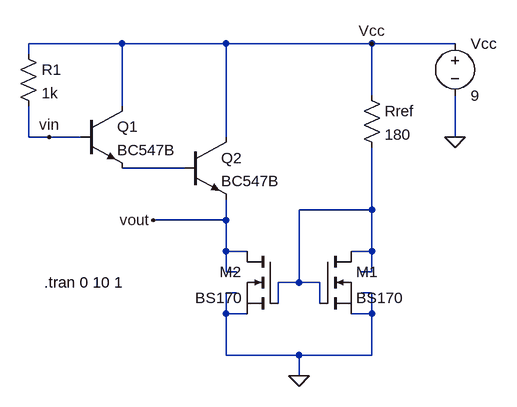
[diagram p0: schematic polasc.asc]
polasc.asc, the LTspice schematic file:
Version 4
SHEET 1 880 680
WIRE 176 16 32 16
WIRE 336 16 176 16
WIRE 560 16 336 16
WIRE 688 16 560 16
WIRE 32 32 32 16
WIRE 560 96 560 16
WIRE 176 112 176 16
WIRE 32 160 32 112
WIRE 64 160 32 160
WIRE 112 160 64 160
WIRE 336 160 336 16
WIRE 688 160 688 96
WIRE 272 208 176 208
WIRE 560 272 560 176
WIRE 560 272 448 272
WIRE 336 288 336 256
WIRE 336 288 224 288
WIRE 336 336 336 288
WIRE 368 336 336 336
WIRE 560 336 560 272
WIRE 560 336 528 336
WIRE 336 368 336 336
WIRE 352 368 336 368
WIRE 560 368 560 336
WIRE 560 368 544 368
WIRE 448 384 448 272
WIRE 448 384 416 384
WIRE 480 384 448 384
WIRE 352 400 336 400
WIRE 560 400 544 400
WIRE 416 416 416 384
WIRE 480 416 480 384
WIRE 336 432 336 400
WIRE 368 432 336 432
WIRE 560 432 560 400
WIRE 560 432 528 432
WIRE 336 496 336 432
WIRE 448 496 336 496
WIRE 560 496 560 432
WIRE 560 496 448 496
WIRE 448 528 448 496
FLAG 688 160 0
FLAG 64 160 vin
FLAG 448 528 0
FLAG 224 288 vout
FLAG 560 16 Vcc
SYMBOL npn 112 112 R0
SYMATTR InstName Q1
SYMATTR Value BC547B
SYMBOL npn 272 160 R0
SYMATTR InstName Q2
SYMATTR Value BC547B
SYMBOL res 16 16 R0
SYMATTR InstName R1
SYMATTR Value 1k
SYMBOL voltage 688 0 R0
WINDOW 123 0 0 Left 0
WINDOW 39 0 0 Left 0
SYMATTR InstName Vcc
SYMATTR Value 9
SYMBOL res 544 80 R0
SYMATTR InstName Rref
SYMATTR Value 180
SYMBOL nmos 480 336 R0
SYMATTR InstName M1
SYMATTR Value BS170
SYMBOL nmos 416 336 M0
SYMATTR InstName M2
SYMATTR Value BS170
TEXT 56 384 Left 2 !.tran 0 10 1

The netlist it stands for:
* polasc.asc
Q1 Vcc vin N001 0 BC547B
Q2 Vcc N001 vout 0 BC547B
R1 Vcc vin 1k
Vcc Vcc 0 9
Rref Vcc N002 180
M1 N002 N002 0 0 BS170
M2 vout N002 0 0 BS170
.model NPN NPN
.model PNP PNP
.lib standard.bjt
.model NMOS NMOS
.model PMOS PMOS
.lib standard.mos
.tran 0 10 1
.backanno
.end

* Results of the author's LTspice run, read from the files saved beside the schematic
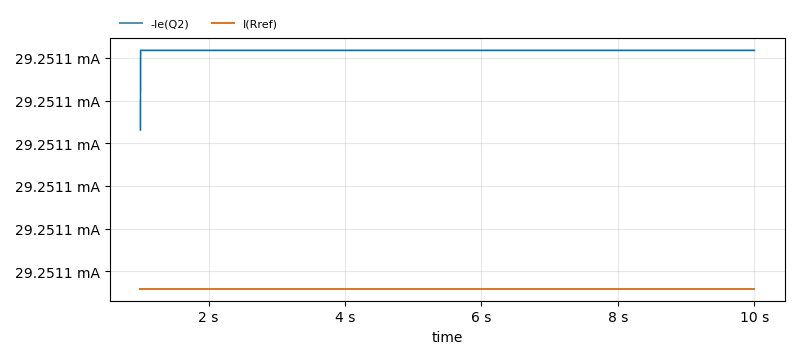
[diagram p1: Transient Analysis of polasc.asc, plotted from the saved traces]
* Transient Analysis, 1 run:
*   -Ie(Q2): min 29.25 mA, max 29.25 mA, average 29.25 mA, rms 29.25 mA, last 29.25 mA
*   I(Rref): min 29.25 mA, max 29.25 mA, average 29.25 mA, rms 29.25 mA, last 29.25 mA